# Altium schematic sheet sfp.SchDoc: =ProjectName
size 420 x 297 mm; Author: G.K.; CompanyName: WUT; DrawnBy: G.K.; Organization: WUT ISE; Address1: Warsaw Univeristy of Technology; Address2: Nowowiejska 15/19; DocumentNumber: 9; Revision: -; SheetNumber: 9; SheetTotal: 12; EDA_Number: ARTIQ; Projet: ARTIQ/SINARA; ModifiedBy: -; CreateDate: XX/XX/XXXX; CheckedDate: -; Title2: sfp.SchDoc; DivGrp: ISE; Designer: G.K.; ModifiedDate: -; ProjectName: ARTIQ/SINARA
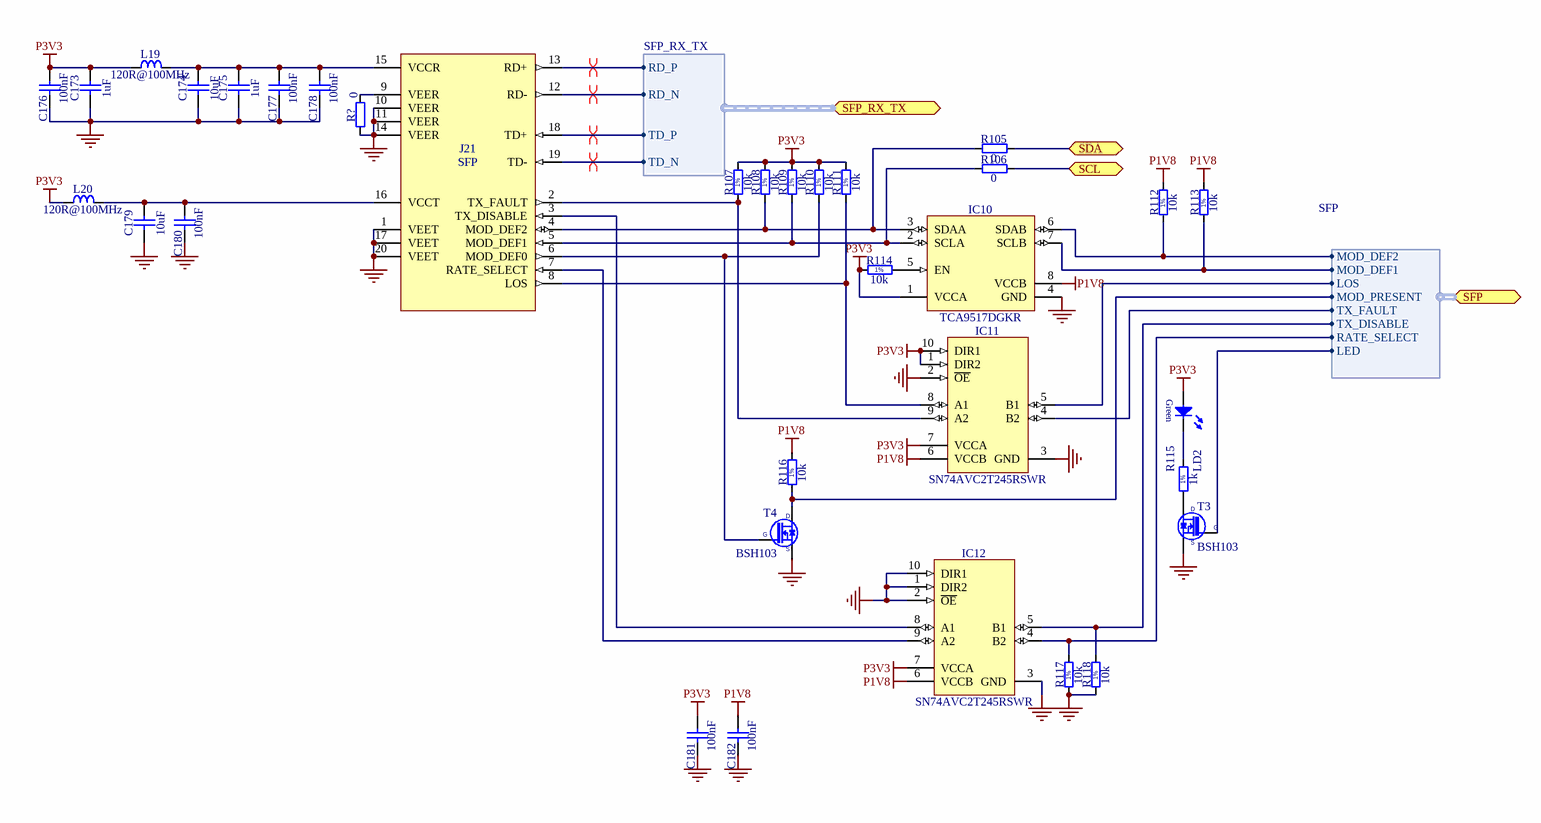
[diagram p0: sfp.SchDoc]

## Parts
C173  1uF  [CAPC1005X55N]
C174  10uF  [CAPC2012X95N]
C175  1uF  [CAPC1005X55N]
C176  100nF  [CAPC0603X33N]
C177  100nF  [CAPC0603X33N]
C178  100nF  [CAPC0603X33N]
C179  10uF  [CAPC2012X95N]
C180  100nF  [CAPC0603X33N]
C181  100nF  [CAPC0603X33N]
C182  100nF  [CAPC0603X33N]
IC10  TCA9517DGKR  [SOP65P490X110-8N]
IC11  SN74AVC2T245RSWR  [QFN40P140X180X55-10N]
IC12  SN74AVC2T245RSWR  [QFN40P140X180X55-10N]
J21  SFP  [TYCO_1367073-1]
L19  120R@100MHz  [INDC1608X65N]
L20  120R@100MHz  [INDC1608X65N]
LD2  Green  [LED_AVAGO_HSME-C120]  (value not drawn)
R105  0  [RESC1608X55N]
R106  0  [RESC1608X55N]
R107  10k  [RESC1005X40N]
R108  10k  [RESC1005X40N]
R109  10k  [RESC1005X40N]
R110  10k  [RESC1005X40N]
R111  10k  [RESC1005X40N]
R112  10k  [RESC1005X40N]
R113  10k  [RESC1005X40N]
R114  10k  [RESC1005X40N]
R115  1k  [RESC1608X55N]
R116  10k  [RESC1005X40N]
R117  10k  [RESC1005X40N]
R118  10k  [RESC1005X40N]
R?  0  [RESC1608X55N]  (no BOM)
T3  BSH103  [SOT95P230X110-3N]
T4  BSH103  [SOT95P230X110-3N]

## Ports
SCL (bidir), SDA (bidir), SFP (harness SFP), SFP_RX_TX (harness SFP_RX_TX)

## Harnesses
SFP_RX_TX: RD_P, RD_N, TD_P, TD_N
SFP: TX_FAULT, LOS, MOD_PRESENT, MOD_DEF1, MOD_DEF2, TX_DISABLE, RATE_SELECT, LED

## Nets
GND: C173.1 C174.1 C175.1 C176.1 C177.1 C178.1 C179.1 C180.1 C181.1 C182.1 IC10.4(GND) IC11.2(~{OE}) IC11.3(GND) IC12.1(DIR2) IC12.2(~{OE}) IC12.3(GND) IC12.10(DIR1) J21.1(VEET) J21.10(VEER) J21.11(VEER) J21.14(VEER) J21.17(VEET) J21.20(VEET) R117.1 R118.1 R?.1 T3.2(S) T4.2(S)
P1V8: C182.2 IC10.8(VCCB) IC11.6(VCCB) IC12.6(VCCB) R112.2 R113.2 R116.2
P3V3: C173.2 C176.2 C181.2 IC10.1(VCCA) IC11.1(DIR2) IC11.7(VCCA) IC11.10(DIR1) IC12.7(VCCA) L19.1 L20.1 LD2.2(A) R107.2 R108.2 R109.2 R110.2 R111.2 R114.1
SCL: R106.2 ; port SCL
SDA: R105.2 ; port SDA
NetC174_2: C174.2 C175.2 C177.2 C178.2 J21.15(VCCR) L19.2
NetC179_2: C179.2 C180.2 J21.16(VCCT) L20.2
NetIC10_2: IC10.2(SCLA) J21.5(MOD_DEF1) R106.1 R109.1
NetIC10_3: IC10.3(SDAA) J21.4(MOD_DEF2) R105.1 R108.1
NetIC10_5: IC10.5(EN) R114.2
NetIC10_6: IC10.6(SDAB) R112.1 ; port SFP.MOD_DEF2
NetIC10_7: IC10.7(SCLB) R113.1 ; port SFP.MOD_DEF1
NetIC11_4: IC11.4(B2) ; port SFP.TX_FAULT
NetIC11_5: IC11.5(B1) ; port SFP.LOS
NetIC11_8: IC11.8(A1) J21.8(LOS) R111.1
NetIC11_9: IC11.9(A2) J21.2(TX_FAULT) R107.1
NetIC12_4: IC12.4(B2) R117.2 ; port SFP.RATE_SELECT
NetIC12_5: IC12.5(B1) R118.2 ; port SFP.TX_DISABLE
NetIC12_8: IC12.8(A1) J21.3(TX_DISABLE)
NetIC12_9: IC12.9(A2) J21.7(RATE_SELECT)
NetJ21_6: J21.6(MOD_DEF0) R110.1 T4.1(G)
NetJ21_9: J21.9(VEER) R?.2
NetJ21_12: J21.12(RD-) ; port SFP_RX_TX.RD_N
NetJ21_13: J21.13(RD+) ; port SFP_RX_TX.RD_P
NetJ21_18: J21.18(TD+) ; port SFP_RX_TX.TD_P
NetJ21_19: J21.19(TD-) ; port SFP_RX_TX.TD_N
NetLD2_1: LD2.1(C) R115.2
NetR115_1: R115.1 T3.3(D)
NetR116_1: R116.1 T4.3(D) ; port SFP.MOD_PRESENT
NetT3_1: T3.1(G) ; port SFP.LED

## Layout directives
differential pair: NetJ21_12, NetJ21_13, NetJ21_18, NetJ21_19

## Notes on the sheet
- Project/Equipment
- Document
- Designer
- Drawn by
- Check.by
- File
- Last Mod.
- Print Date
- Sheet
- Size
- A3
- of
- Rev
- (in symbol R0402_10K_1%_0.0625W_100PPM) 1%
- (in symbol R0603_1K_1%_0.1W_100PPM) 1%

## Library data of the parts
C173 C175 = CC0402_1UF_16V_10%_X5R: Non-polarised capacitor; Part Description: SMD Multilayer Chip Ceramic Capacitor; Manufacturer: GENERIC; Manufacturer1 Part Number: C1005X5R1C105KT; Voltage: 16V; TC: X5R; Tolerance: ±10%; Part Number: CC0402_1UF_16V_10%_X5R; Component Kind: Standard; Component Type: Standard; Pin Count: 2; Value: 1uF; Status: Preferred; Manufacturer Part Number: CC0402_1UF_16V_10%_X5R; Case: 0402; Mounted: Yes; Socket: No; SMD: Yes; Sense: No; Manufacturer1 Example: TDK; Manufacturer1 ComponentHeight: 0.55mm; HelpURL: \\cern.ch\dfs\Applications\Altium\Datasheets\CC0402_X5R_TDK_C.pdf; Author: CERN DEM JLC; CreateDate: 2012-10-25; LatestRevisionDate: 2012-10-25
C174 C179 = CC0805_10UF_25V_10%_X5R: Non-polarised capacitor; Part Description: SMD Multilayer Chip Ceramic Capacitor; Manufacturer: GENERIC; Manufacturer1 Part Number: GRM219R61E106KA12D; Voltage: 25V; TC: X5R; Tolerance: ±10%; Part Number: CC0805_10UF_25V_10%_X5R; Component Kind: Standard; Component Type: Standard; Pin Count: 2; Value: 10uF; Status: Preferred; Manufacturer Part Number: CC0805_10UF_25V_10%_X5R; Case: 0805; Mounted: Yes; Socket: No; SMD: Yes; Sense: No; Manufacturer1 Example: MURATA; Manufacturer1 ComponentHeight: 0.95mm; HelpURL: \\cern.ch\dfs\Applications\Altium\Datasheets\CC0805_X5R_MURATA_GRM.pdf; Author: CERN DEM JLC; CreateDate: 25.10.2012; LatestRevisionDate: 06.09.2016
C176-C178 C180-C182 = CC0201_100NF_6.3V_10%_X5R: Non-polarised capacitor; Part Description: SMD Multilayer Chip Ceramic Capacitor; Manufacturer: GENERIC; Manufacturer1 Part Number: 02016D104KAT2A; Voltage: 6.3V; TC: X5R; Tolerance: ±10%; Part Number: CC0201_100NF_6.3V_10%_X5R; Component Kind: Standard; Component Type: Standard; Pin Count: 2; Value: 100nF; Status: Not Recommended; Manufacturer Part Number: CC0201_100NF_6.3V_10%_X5R; Case: 0201; Mounted: Yes; Socket: No; SMD: Yes; Sense: No; Manufacturer1 Example: AVX; Manufacturer1 ComponentHeight: 0.33mm; HelpURL: \\cern.ch\dfs\Applications\Altium\Datasheets\CC0201_X5R_AVX.pdf; Author: CERN DEM JLC; CreateDate: 2007-12-03; LatestRevisionDate: 2007-12-03
IC10 = TCA9517DGKR: Level-Translating I2C Bus Repeater; Manufacturer: TEXAS INSTRUMENTS; PressFit: No; Bonding: No; Part Number: TCA9517DGKR; Component Kind: Standard; Component Type: Standard; Device: TCA9517DGKR; PackageDescription: SOP, 0.65mm, Pitch; 8 Pin, 3.0mm W X 3.0mm L X 1.10mm H Body, IPC Medium Density; Part Description: Level-Translating I2C Bus Repeater; Manufacturer Part Number: TCA9517DGKR; Pin Count: 8; Case: TSSOP8; Mounted: Yes; Socket: No; SMD: Yes; Sense: No; ComponentHeight: 1.1mm; Author: CERN DEM JLC; HelpURL: \\cern.ch\dfs\Applications\Altium\Datasheets\TCA9517DGKR.pdf; CreateDate: 07.07.2014; LatestRevisionDate: 07.07.2014
IC11 IC12 = SN74AVC2T245RSWR: Dual-Bit Dual-Supply Bus Transceiver With Configurable Voltage Translation and 3-State Outputs; Manufacturer: TEXAS INSTRUMENTS; PressFit: No; Bonding: No; Part Number: SN74AVC2T245RSWR; Component Kind: Standard; Component Type: Standard; Device: SN74AVC2T245RSWR; PackageDescription: QFN, 0.40mm Pitch, Rect.;10 Pin, 1.80mm L X 1.40mm W X 0.55mm H Body, IPC Medium Density; Status: Not Recommended; Part Description: Dual-Bit Dual-Supply Bus Transceiver With Configurable Voltage Translation and 3-State Outputs; Manufacturer Part Number: SN74AVC2T245RSWR; Pin Count: 10; Case: QFN10; Mounted: Yes; Socket: No; SMD: Yes; Sense: No; ComponentHeight: 0.55mm; Author: CERN DEM JLC; HelpURL: \\cern.ch\dfs\Applications\Altium\Datasheets\SN74AVC2T245RSWR.pdf; CreateDate: 07.07.2014; LatestRevisionDate: 30.03.2017
J21 = TYCO_1367073-1: 20 Position SFP  Connector (Small Form-factor Pluggable); Part Description: 20 Position, Pitch 0.8mm SFP Receptacle (Small Form-factor Pluggable); Manufacturer: TYCO ELECTRONICS; PressFit: No; Part Number: TYCO_1367073-1; Component Kind: Standard; Component Type: Standard; Pin Count: 20; Family: SFP; Mounted: Yes; Socket: No; SMD: Yes; Sense: No; Status: None; Manufacturer Part Number: 1367073-1; ComponentHeight: 5.4mm; ComponentLink1URL: \\cern.ch\dfs\Applications\Altium\Datasheets\TYCO_SFP_Application.pdf; ComponentLink1Description: Application; ComponentLink2URL: \\cern.ch\dfs\Applications\Altium\Datasheets\Tyco_SFP_Specification.pdf; ComponentLink2Description: SFP Specification; HelpURL: \\cern.ch\dfs\Applications\Altium\Datasheets\TYCO_1367073-1.pdf; Author: CERN DEM JLC; CreateDate: 25.01.2010; LatestRevisionDate: 25.01.2010
L19 L20 = IND0603_MURATA_BLM18SG121TN1D: Inductor; Part Description: SMD EMIFIL Suppression Chip Ferrite Bead; Manufacturer: MURATA; Power: 3A; Resistance: 0.025R; Tolerance: ±25%; Part Number: IND0603_MURATA_BLM18SG121TN1D; Component Kind: Standard; Component Type: Standard; Pin Count: 2; Value: 120R@100MHz; Status: None; Manufacturer Part Number: BLM18SG121TN1D; Case: 0603; Mounted: Yes; Socket: No; SMD: Yes; Sense: No; ComponentHeight: 0.65mm; HelpURL: \\cern.ch\dfs\Applications\Altium\Datasheets\IND0603_MURATA_BLM18S.pdf; Author: CERN DEM JLC; CreateDate: 23.07.2014; LatestRevisionDate: 23.07.2014
LD2 = LED_AVAGO_HSME-C120: LED Green 1C 2A; Part Description: High Performance Right Angle Chip Green LED; Manufacturer: AVAGO TECHNOLOGIES; PressFit: No; Bonding: No; Part Number: LED_AVAGO_HSME-C120; Component Kind: Standard; Component Type: Standard; Color: Green; PackageDescription: Green Chip LED, 2-Leads, Body 1.7x1.1mm, Side Emitting Package; Manufacturer Part Number: HSME-C120; Pin Count: 2; Mounted: Yes; Socket: No; SMD: Yes; Sense: No; ComponentHeight: 0.7mm; HelpURL: \\cern.ch\dfs\Applications\Altium\Datasheets\LED_AVAGO_HSME-C120.pdf; ComponentLink1URL: \\cern.ch\dfs\Applications\Altium\Datasheets\LED_AVAGO_HSME-C110_DESIGN-GUIDE.pdf; ComponentLink1Description: Design Guide; Author: CERN DEM JMW; CreateDate: 22.07.2009; LatestRevisionDate: 20.06.2012
R105 R106 R? = R0603_0R_JUMPER: Resistor; Part Description: 1A (0.05R Max DC Resistance) Zero Ohm Jumper; Manufacturer: GENERIC; Manufacturer1 Part Number: NRC06Z0; Part Number: R0603_0R_JUMPER; Component Type: Standard; Pin Count: 2; Value: 0; Status: Preferred; Manufacturer Part Number: R0603_0R_JUMPER; Case: 0603; Mounted: Yes; Sense: No; Socket: No; SMD: Yes; Manufacturer1 Example: NIC COMPONENT; Manufacturer1 ComponentHeight: 0.55mm; HelpURL: \\cern.ch\dfs\Applications\Altium\Datasheets\R0603_NIC_NRC.pdf; Author: CERN DEM JLC; CreateDate: 03.12.2007; LatestRevisionDate: 13.03.2008
  R105 R106: Component Kind: Standard
R107-R114 R116-R118 = R0402_10K_1%_0.0625W_100PPM: Resistor - 1%; Part Description: General Purpose Thick Film Chip Resistor; Manufacturer: GENERIC; Manufacturer1 Part Number: 232270671003L; TC: ±100ppm/°C; PressFit: No; Part Number: R0402_10K_1%_0.0625W_100PPM; Component Kind: Standard; Component Type: Standard; Pin Count: 2; Value: 10k; Status: Not Recommended; Power: 0.0625W; Tolerance: ±1%; Manufacturer Part Number: R0402_10K_1%_0.0625W_100PPM; Case: 0402; Mounted: Yes; Sense: No; Socket: No; SMD: Yes; Manufacturer1 Example: YAGEO PHYCOMP; Manufacturer1 ComponentHeight: 0.4mm; HelpURL: \\cern.ch\dfs\Applications\Altium\Datasheets\R0402_Phycomp_RC0402.pdf; Author: CERN DEM JLC; CreateDate: 03.12.2007; LatestRevisionDate: 17.10.2012
R115 = R0603_1K_1%_0.1W_100PPM: Resistor - 1%; Part Description: General Purpose Thick Film Chip Resistor; Manufacturer: GENERIC; Manufacturer1 Part Number: NRC06F1001TRF; Power: 0.1W; TC: ±100ppm/°C; Part Number: R0603_1K_1%_0.1W_100PPM; Component Kind: Standard; Component Type: Standard; Pin Count: 2; Value: 1k; Status: Preferred; Tolerance: ±1%; Manufacturer Part Number: R0603_1K_1%_0.1W_100PPM; Case: 0603; Mounted: Yes; Sense: No; Socket: No; SMD: Yes; Manufacturer1 Example: NIC COMPONENT; Manufacturer1 ComponentHeight: 0.55mm; HelpURL: \\cern.ch\dfs\Applications\Altium\Datasheets\R0603_NIC_NRC.pdf; Author: CERN DEM JLC; CreateDate: 03.12.2007; LatestRevisionDate: 13.03.2008
T3 T4 = BSH103: N-CHANNEL MOSFET WITH DIODE; Part Description: 30V 850mA N-Channel Enhancement Mode Field-Effect Transistor; Manufacturer: NEXPERIA; PressFit: No; Bonding: No; Part Number: BSH103; Component Kind: Standard; Component Type: Standard; Device: BSH103; PackageDescription: SOT23, 3 pin, Pitch 0.95mm - 1.3mm W X 2.9mm L X 1.1mm H, IPC Medium Density; Manufacturer Part Number: BSH103; Pin Count: 3; Case: SOT23-3; Mounted: Yes; Socket: No; SMD: Yes; Sense: No; ComponentHeight: 1.1mm; HelpURL: \\cern.ch\dfs\Applications\Altium\Datasheets\BSH103.pdf; Author: CERN DEM JLC; CreateDate: 16.03.2010; LatestRevisionDate: 20.06.2017